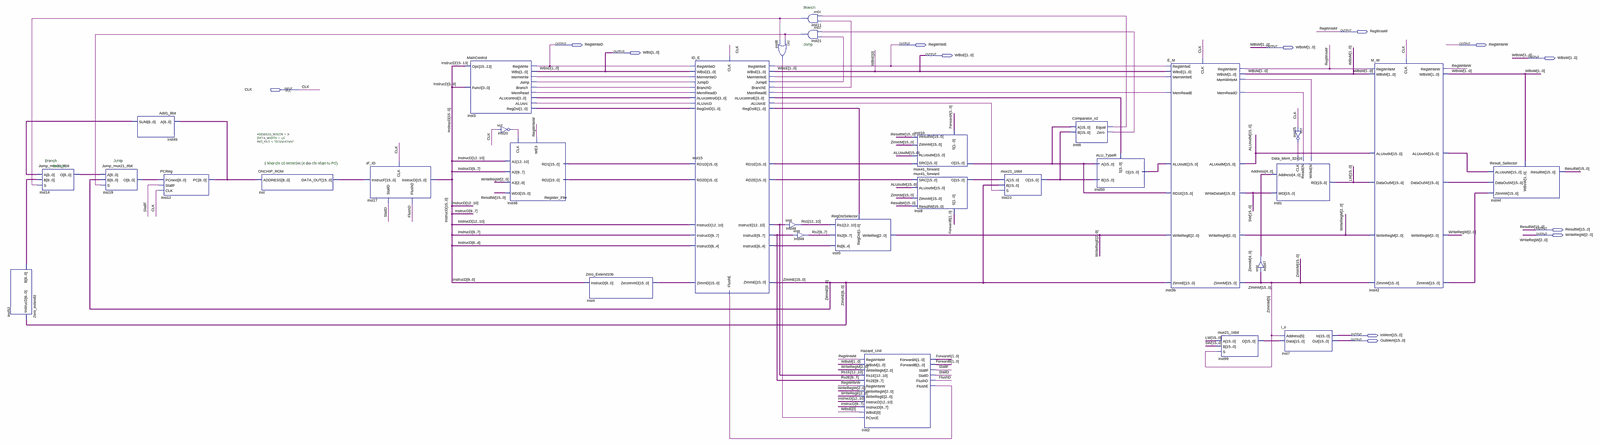
[diagram p0: schematic sheet, whole]
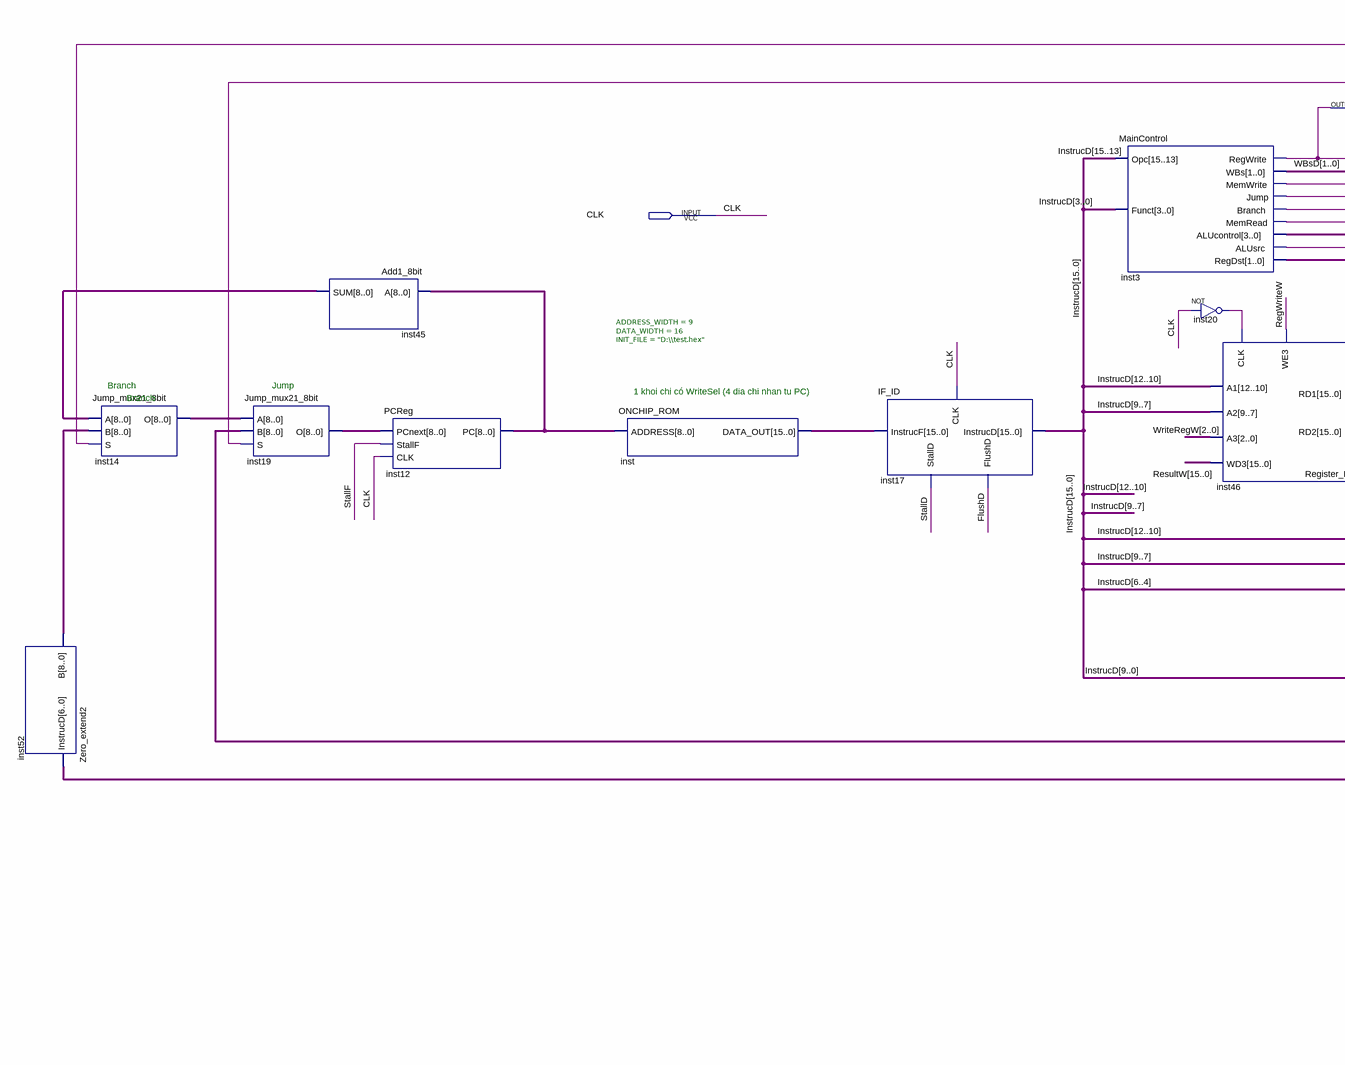
[diagram p1: schematic sheet, left part]
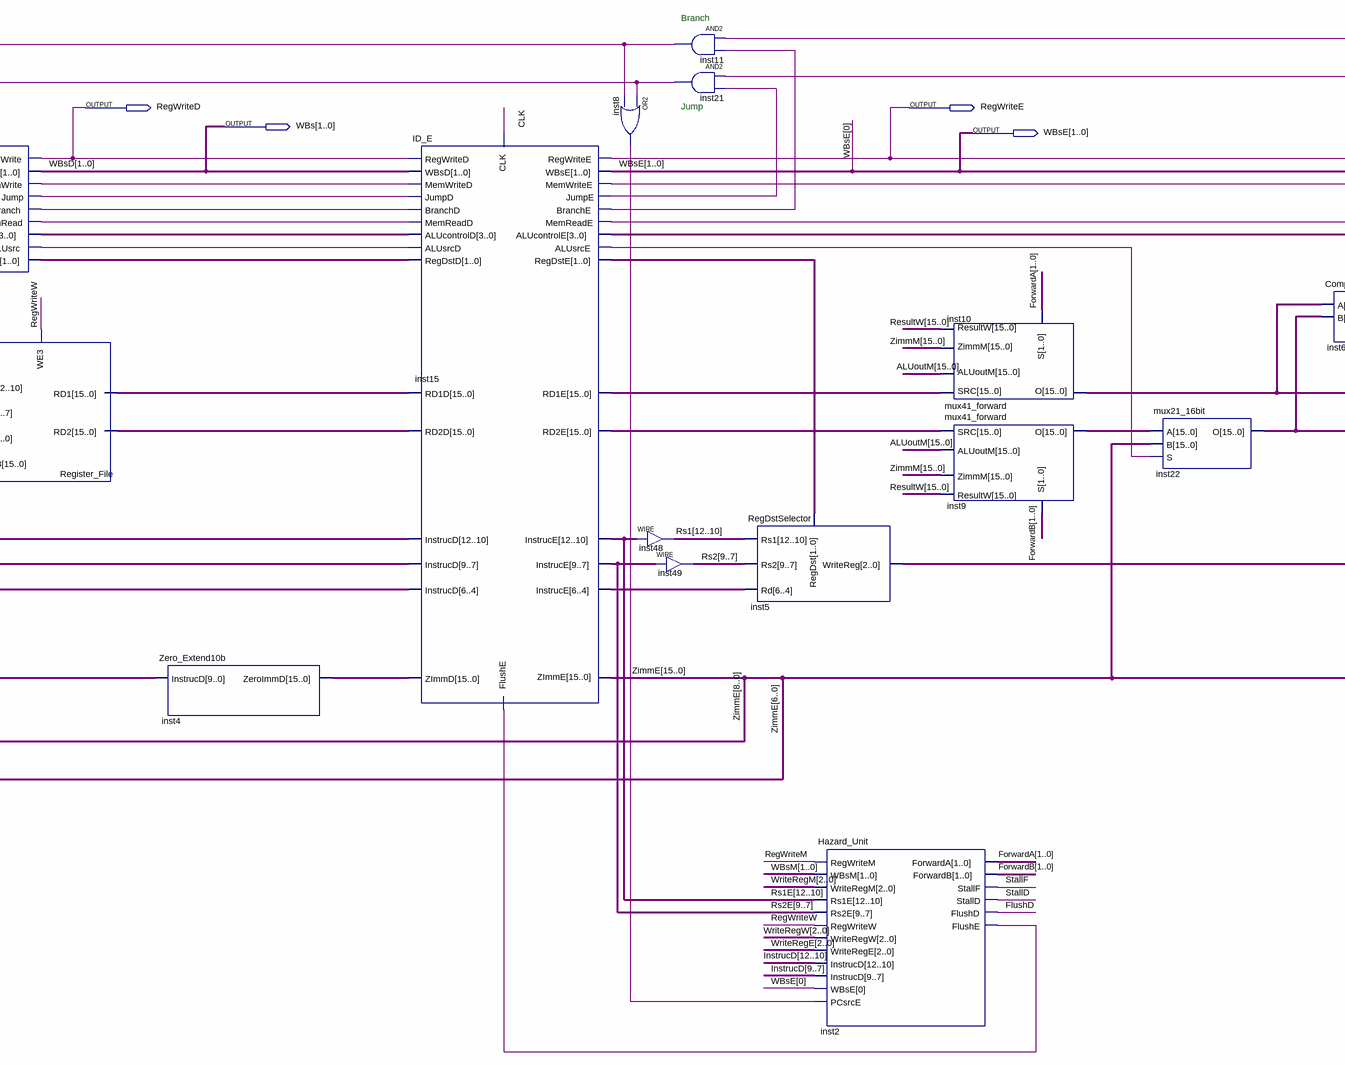
[diagram p2: schematic sheet, centre part]
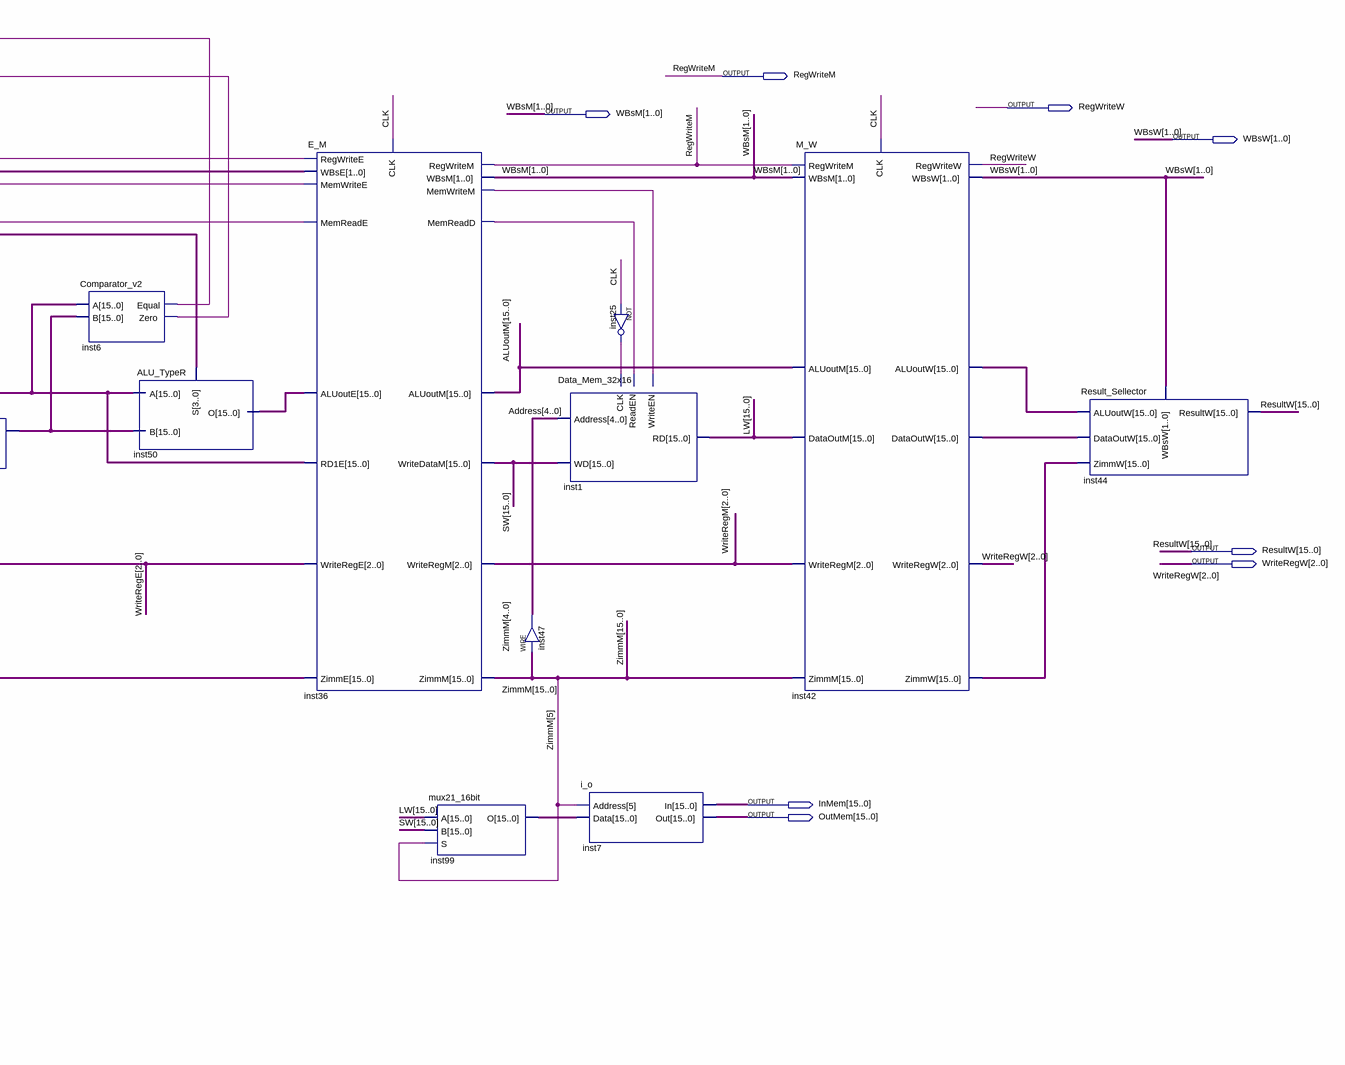
[diagram p3: schematic sheet, right part]
// Quartus schematic CPU_vippro.bdf as structural Verilog: 32 symbols, 13 pins
module CPU_vippro (
  input  CLK,
  output RegWriteM,
  output RegWriteD,
  output RegWriteE,
  output RegWriteW,
  output [1:0] WBsM,
  output [1:0] WBs,
  output [1:0] WBsE,
  output [1:0] WBsW,
  output [15:0] ResultW,
  output [2:0] WriteRegW,
  output [15:0] InMem,
  output [15:0] OutMem
);

  wire FlushD, inst2_flushe, inst3_alusrc, inst3_branch, inst3_jump, inst3_memread, inst3_memwrite,
       inst6_equal, inst6_zero, inst8_out, inst11_out, inst15_alusrce, inst15_branche, inst15_jumpe,
       inst15_memreade, inst15_memwritee, inst20_out, inst21_out, inst25_out, inst36_memreadd,
       inst36_memwritem, StallD, StallF;
  wire [1:0] ForwardA, ForwardB, inst3_regdst, inst15_regdste;
  wire [2:0] inst15_instruce, WriteRegE, WriteRegM;
  wire [3:0] inst3_alucontrol, inst15_alucontrole;
  wire [4:0] Address;
  wire [8:0] inst12_pc, inst14_o, inst19_o, inst45_sum, inst52_b;
  wire [9:7] Rs2, Rs2E;
  wire [12:10] Rs1, Rs1E;
  wire [15:0] ALUoutM, inst4_zeroimmd, inst9_o, inst10_o, inst15_rd1e, inst15_rd2e, inst22_o, inst42_aluoutw,
       inst42_dataoutw, inst42_zimmw, inst46_rd1, inst46_rd2, inst50_o, inst99_o, inst_data_out, InstrucD,
       LW, SW, ZimmE, ZimmM;

  Zero_extend2 inst52 (.InstrucD(ZimmE[6:0]), .B(inst52_b));
  Jump_mux21_8bit inst14 (.A(inst45_sum), .B(inst52_b), .S(inst11_out), .O(inst14_o));
  Jump_mux21_8bit inst19 (.A(inst14_o), .B(ZimmE[8:0]), .S(inst21_out), .O(inst19_o));
  Add1_8bit inst45 (.A(inst12_pc), .SUM(inst45_sum));
  PCReg inst12 (.PCnext(inst19_o), .StallF(StallF), .CLK(CLK), .PC(inst12_pc));
  ONCHIP_ROM #(.ADDRESS_WIDTH(9), .DATA_WIDTH(16), .INIT_FILE("D:\\test.hex")) inst (
    .ADDRESS(inst12_pc), .DATA_OUT(inst_data_out));
  IF_ID inst17 (.CLK(CLK), .InstrucF(inst_data_out), .StallD(StallD), .FlushD(FlushD), .InstrucD(InstrucD));
  MainControl inst3 (
    .Opc(InstrucD[15:13]), .Funct(InstrucD[3:0]), .ALUcontrol(inst3_alucontrol), .RegDst(inst3_regdst),
    .Branch(inst3_branch), .MemRead(inst3_memread), .WBs(WBs), .MemWrite(inst3_memwrite),
    .ALUsrc(inst3_alusrc), .RegWrite(RegWriteD), .Jump(inst3_jump));
  not inst20 (inst20_out, CLK);
  Register_File inst46 (
    .WE3(RegWriteW), .CLK(inst20_out), .A1(InstrucD[12:10]), .A2(InstrucD[9:7]), .A3(WriteRegW),
    .WD3(ResultW), .RD1(inst46_rd1), .RD2(inst46_rd2));
  Zero_Extend10b inst4 (.InstrucD(InstrucD[9:0]), .ZeroImmD(inst4_zeroimmd));
  ID_E inst15 (
    .CLK(CLK), .FlushE(inst2_flushe), .RegWriteD(RegWriteD), .WBsD(WBs), .MemWriteD(inst3_memwrite),
    .JumpD(inst3_jump), .BranchD(inst3_branch), .MemReadD(inst3_memread), .ALUcontrolD(inst3_alucontrol),
    .ALUsrcD(inst3_alusrc), .RegDstD(inst3_regdst), .RD1D(inst46_rd1), .RD2D(inst46_rd2),
    .InstrucD(InstrucD[12:4]), .ZImmD(inst4_zeroimmd), .RegWriteE(RegWriteE), .WBsE(WBsE),
    .MemWriteE(inst15_memwritee), .JumpE(inst15_jumpe), .BranchE(inst15_branche), .MemReadE(inst15_memreade),
    .ALUcontrolE(inst15_alucontrole), .ALUsrcE(inst15_alusrce), .RegDstE(inst15_regdste), .RD1E(inst15_rd1e),
    .RD2E(inst15_rd2e), .InstrucE({Rs1E, Rs2E, inst15_instruce}), .ZImmE(ZimmE));
  or inst8 (inst8_out, inst21_out, inst11_out);
  assign Rs1 = Rs1E;  // WIRE inst48
  and inst11 (inst11_out, inst6_equal, inst15_branche);
  and inst21 (inst21_out, inst6_zero, inst15_jumpe);
  assign Rs2 = Rs2E;  // WIRE inst49
  RegDstSelector inst5 (.Rs1(Rs1), .Rs2(Rs2), .Rd(inst15_instruce), .RegDst(inst15_regdste), .WriteReg(WriteRegE));
  Hazard_Unit inst2 (
    .RegWriteM(RegWriteM), .WBsM(WBsM), .WriteRegM(WriteRegM), .Rs1E(Rs1E), .Rs2E(Rs2E),
    .RegWriteW(RegWriteW), .WriteRegW(WriteRegW), .WriteRegE(WriteRegE), .InstrucD(InstrucD[12:7]),
    .WBsE(WBsE[0]), .PCsrcE(inst8_out), .ForwardA(ForwardA), .ForwardB(ForwardB), .StallF(StallF),
    .StallD(StallD), .FlushD(FlushD), .FlushE(inst2_flushe));
  mux41_forward inst10 (
    .SRC(inst15_rd1e), .ALUoutM(ALUoutM), .ZimmM(ZimmM), .ResultW(ResultW), .S(ForwardA), .O(inst10_o));
  mux41_forward inst9 (
    .SRC(inst15_rd2e), .ALUoutM(ALUoutM), .ZimmM(ZimmM), .ResultW(ResultW), .S(ForwardB), .O(inst9_o));
  mux21_16bit inst22 (.A(inst9_o), .B(ZimmE), .S(inst15_alusrce), .O(inst22_o));
  Comparator_v2 inst6 (.A(inst10_o), .B(inst22_o), .Equal(inst6_equal), .Zero(inst6_zero));
  ALU_TypeR inst50 (.A(inst10_o), .B(inst22_o), .S(inst15_alucontrole), .O(inst50_o));
  E_M inst36 (
    .CLK(CLK), .RegWriteE(RegWriteE), .WBsE(WBsE), .MemWriteE(inst15_memwritee), .MemReadE(inst15_memreade),
    .ALUoutE(inst50_o), .RD1E(inst10_o), .WriteRegE(WriteRegE), .ZimmE(ZimmE), .RegWriteM(RegWriteM),
    .WBsM(WBsM), .MemWriteM(inst36_memwritem), .MemReadD(inst36_memreadd), .ALUoutM(ALUoutM),
    .WriteDataM(SW), .WriteRegM(WriteRegM), .ZimmM(ZimmM));
  mux21_16bit inst99 (.A(LW), .B(SW), .S(ZimmM[5]), .O(inst99_o));
  assign Address = ZimmM[4:0];  // WIRE inst47
  Data_Mem_32x16 inst1 (
    .WD(SW), .CLK(inst25_out), .ReadEN(inst36_memreadd), .Address(Address), .WriteEN(inst36_memwritem),
    .RD(LW));
  not inst25 (inst25_out, CLK);
  i_o inst7 (.Address(ZimmM[5]), .Data(inst99_o), .In(InMem), .Out(OutMem));
  M_W inst42 (
    .CLK(CLK), .RegWriteM(RegWriteM), .WBsM(WBsM), .ALUoutM(ALUoutM), .DataOutM(LW), .WriteRegM(WriteRegM),
    .ZimmM(ZimmM), .RegWriteW(RegWriteW), .WBsW(WBsW), .ALUoutW(inst42_aluoutw), .DataOutW(inst42_dataoutw),
    .WriteRegW(WriteRegW), .ZimmW(inst42_zimmw));
  Result_Sellector inst44 (
    .ALUoutW(inst42_aluoutw), .DataOutW(inst42_dataoutw), .ZimmW(inst42_zimmw), .WBsW(WBsW), .ResultW(ResultW));

  // Other names for the same wires on the sheet: WBsD[1:0] = WBs

  // Notes on the sheet:
  //   Branch
  //   Jump
  //   Branch
  //   Jump
  //   1 khoi chi có WriteSel (4 dia chi nhan tu PC)
  //   Branch
endmodule
